# EAGLE schematic Encoder (EAGLE 9.6.2)
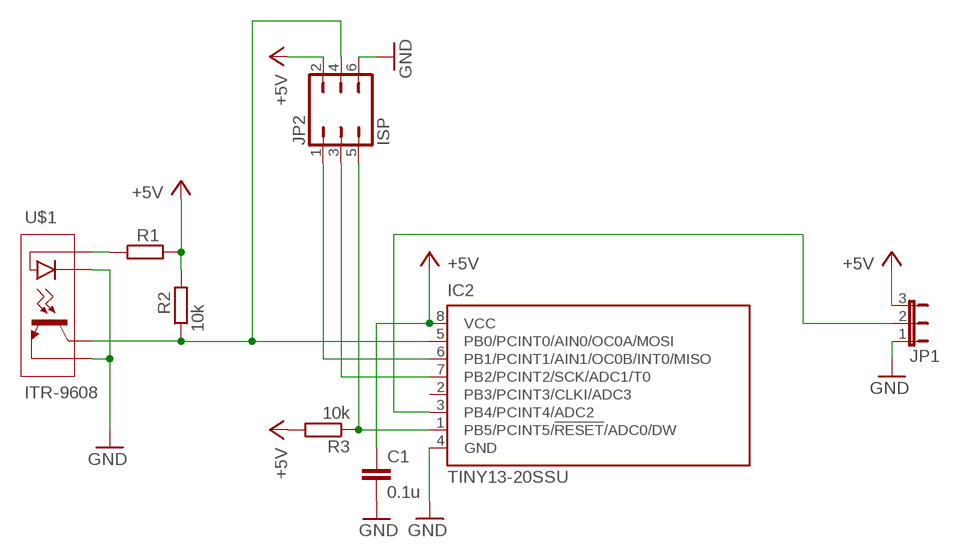
[diagram p0: schematic, sheet 1]

## Parts
C1  0.1u  C-EUC0805  [C0805]
IC2  TINY13-20SSU  [8S1]
JP1  JP2E  [JP2]
JP2  ISP  JP3Q  [JP3Q]
R1  R-EU_M0805  [M0805]
R2  10k  R-EU_M0805  [M0805]
R3  10k  R-EU_M0805  [M0805]
U$1  ITR-9608  [ITR-9608-FOOTPRINT]

## Nets
!RES: IC2.1(PB5/PCINT5/!RESET!/ADC0/DW) JP2.5 R3.1
+5V: C1.1 IC2.8(VCC) JP1.3 JP2.2 R1.2 R2.2 R3.2
DATA-IN: IC2.5(PB0/PCINT0/AIN0/OC0A/MOSI) JP2.4 R2.1 U$1.C
DATA-OUT: IC2.3(PB4/PCINT4/ADC2) JP1.2
GND: C1.2 IC2.4(GND) JP1.1 JP2.6 U$1.E U$1.K
N$1: IC2.6(PB1/PCINT1/AIN1/OC0B/INT0/MISO) JP2.1
N$2: R1.1 U$1.A
N$3: IC2.7(PB2/PCINT2/SCK/ADC1/T0) JP2.3
Unconnected: IC2.2(PB3/PCINT3/CLKI/ADC3)

## Library data of the parts
C1 = rcl:C-EU: CAPACITOR, European symbol; SPICEPREFIX: C
IC2 = atmel:TINY13: 8-bit AVR Microcontroller with 1K Bytes In-System Programmable Flash Source: http://www.atmel.com/dyn/resources/prod_documents/2535S.pdf; MPN: ATTINY13-20SSU; OC_FARNELL: 1455133; OC_NEWARK: 58M3771
JP1 = jumper:JP2E: JUMPER
JP2 = jumper:JP3Q: JUMPER
R1-R3 = rcl:R-EU_: RESISTOR, European symbol; SPICEPREFIX: R
U$1 = EncoderLib:ITR-9608